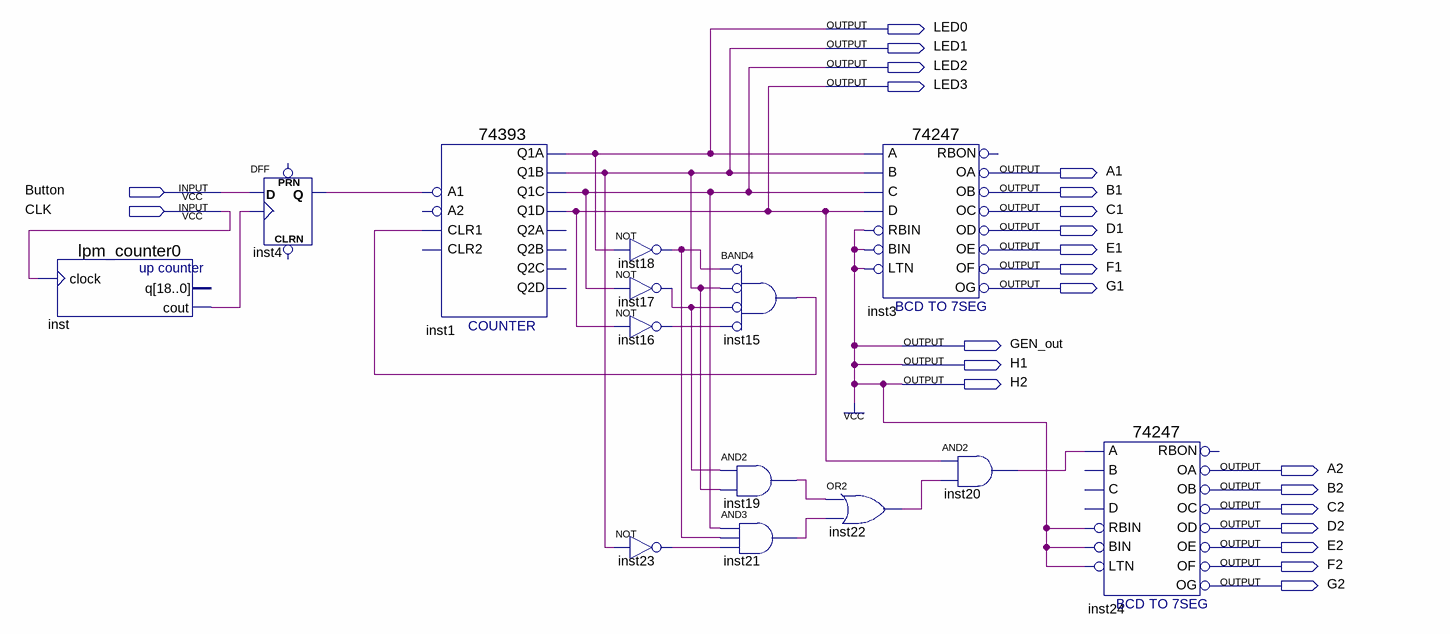
[diagram p0: schematic sheet]
// Quartus schematic lab6-2.bdf as structural Verilog: 14 symbols, 23 pins
module \lab6-2  (
  input  Button,
  input  CLK,
  output LED0,
  output LED1,
  output LED2,
  output LED3,
  output A1,
  output B1,
  output C1,
  output D1,
  output E1,
  output F1,
  output G1,
  output GEN_out,
  output H1,
  output H2,
  output A2,
  output B2,
  output C2,
  output D2,
  output E2,
  output F2,
  output G2
);

  wire inst4_q, inst15_out, inst16_out, inst17_out, inst18_out, inst19_out, inst20_out, inst21_out,
       inst22_out, inst23_out, inst_cout;

  lpm_counter0 inst (.clock(CLK), .cout(inst_cout));  // open: q
  DFF inst4 (.CLK(inst_cout), .D(Button), .Q(inst4_q));  // open: CLRN, PRN
  \74393  inst1 (
    .A1(inst4_q), .CLR1(inst15_out), .Q1C(LED2), .Q1D(LED3), .Q1A(LED0), .Q1B(LED1));  // open: A2, CLR2, Q2D, Q2C, Q2B, Q2A
  not inst18 (inst18_out, LED0);
  not inst17 (inst17_out, LED2);
  not inst16 (inst16_out, LED3);
  not inst23 (inst23_out, LED1);
  and inst15 (inst15_out, ~inst18_out, ~LED1, ~inst17_out, ~inst16_out);  // BAND4
  and inst19 (inst19_out, inst17_out, LED1);
  and inst21 (inst21_out, LED2, inst18_out, inst23_out);
  \74247  inst3 (
    .LTN(1'b1), .BIN(1'b1), .A(LED0), .B(LED1), .RBIN(1'b1), .C(LED2), .D(LED3), .OF(F1), .OC(C1), .OD(D1),
    .OE(E1), .OA(A1), .OB(B1), .OG(G1));  // open: RBON
  or inst22 (inst22_out, inst19_out, inst21_out);
  and inst20 (inst20_out, LED3, inst22_out);
  \74247  inst24 (
    .LTN(1'b1), .BIN(1'b1), .A(inst20_out), .RBIN(1'b1), .OF(F2), .OC(C2), .OD(D2), .OE(E2), .OA(A2),
    .OB(B2), .OG(G2));  // open: B, C, D, RBON

  assign GEN_out = 1'b1;
  assign H1 = 1'b1;
  assign H2 = 1'b1;
endmodule
